# EAGLE design OP_Current_Fun-V0_1 (EAGLE 6.3)
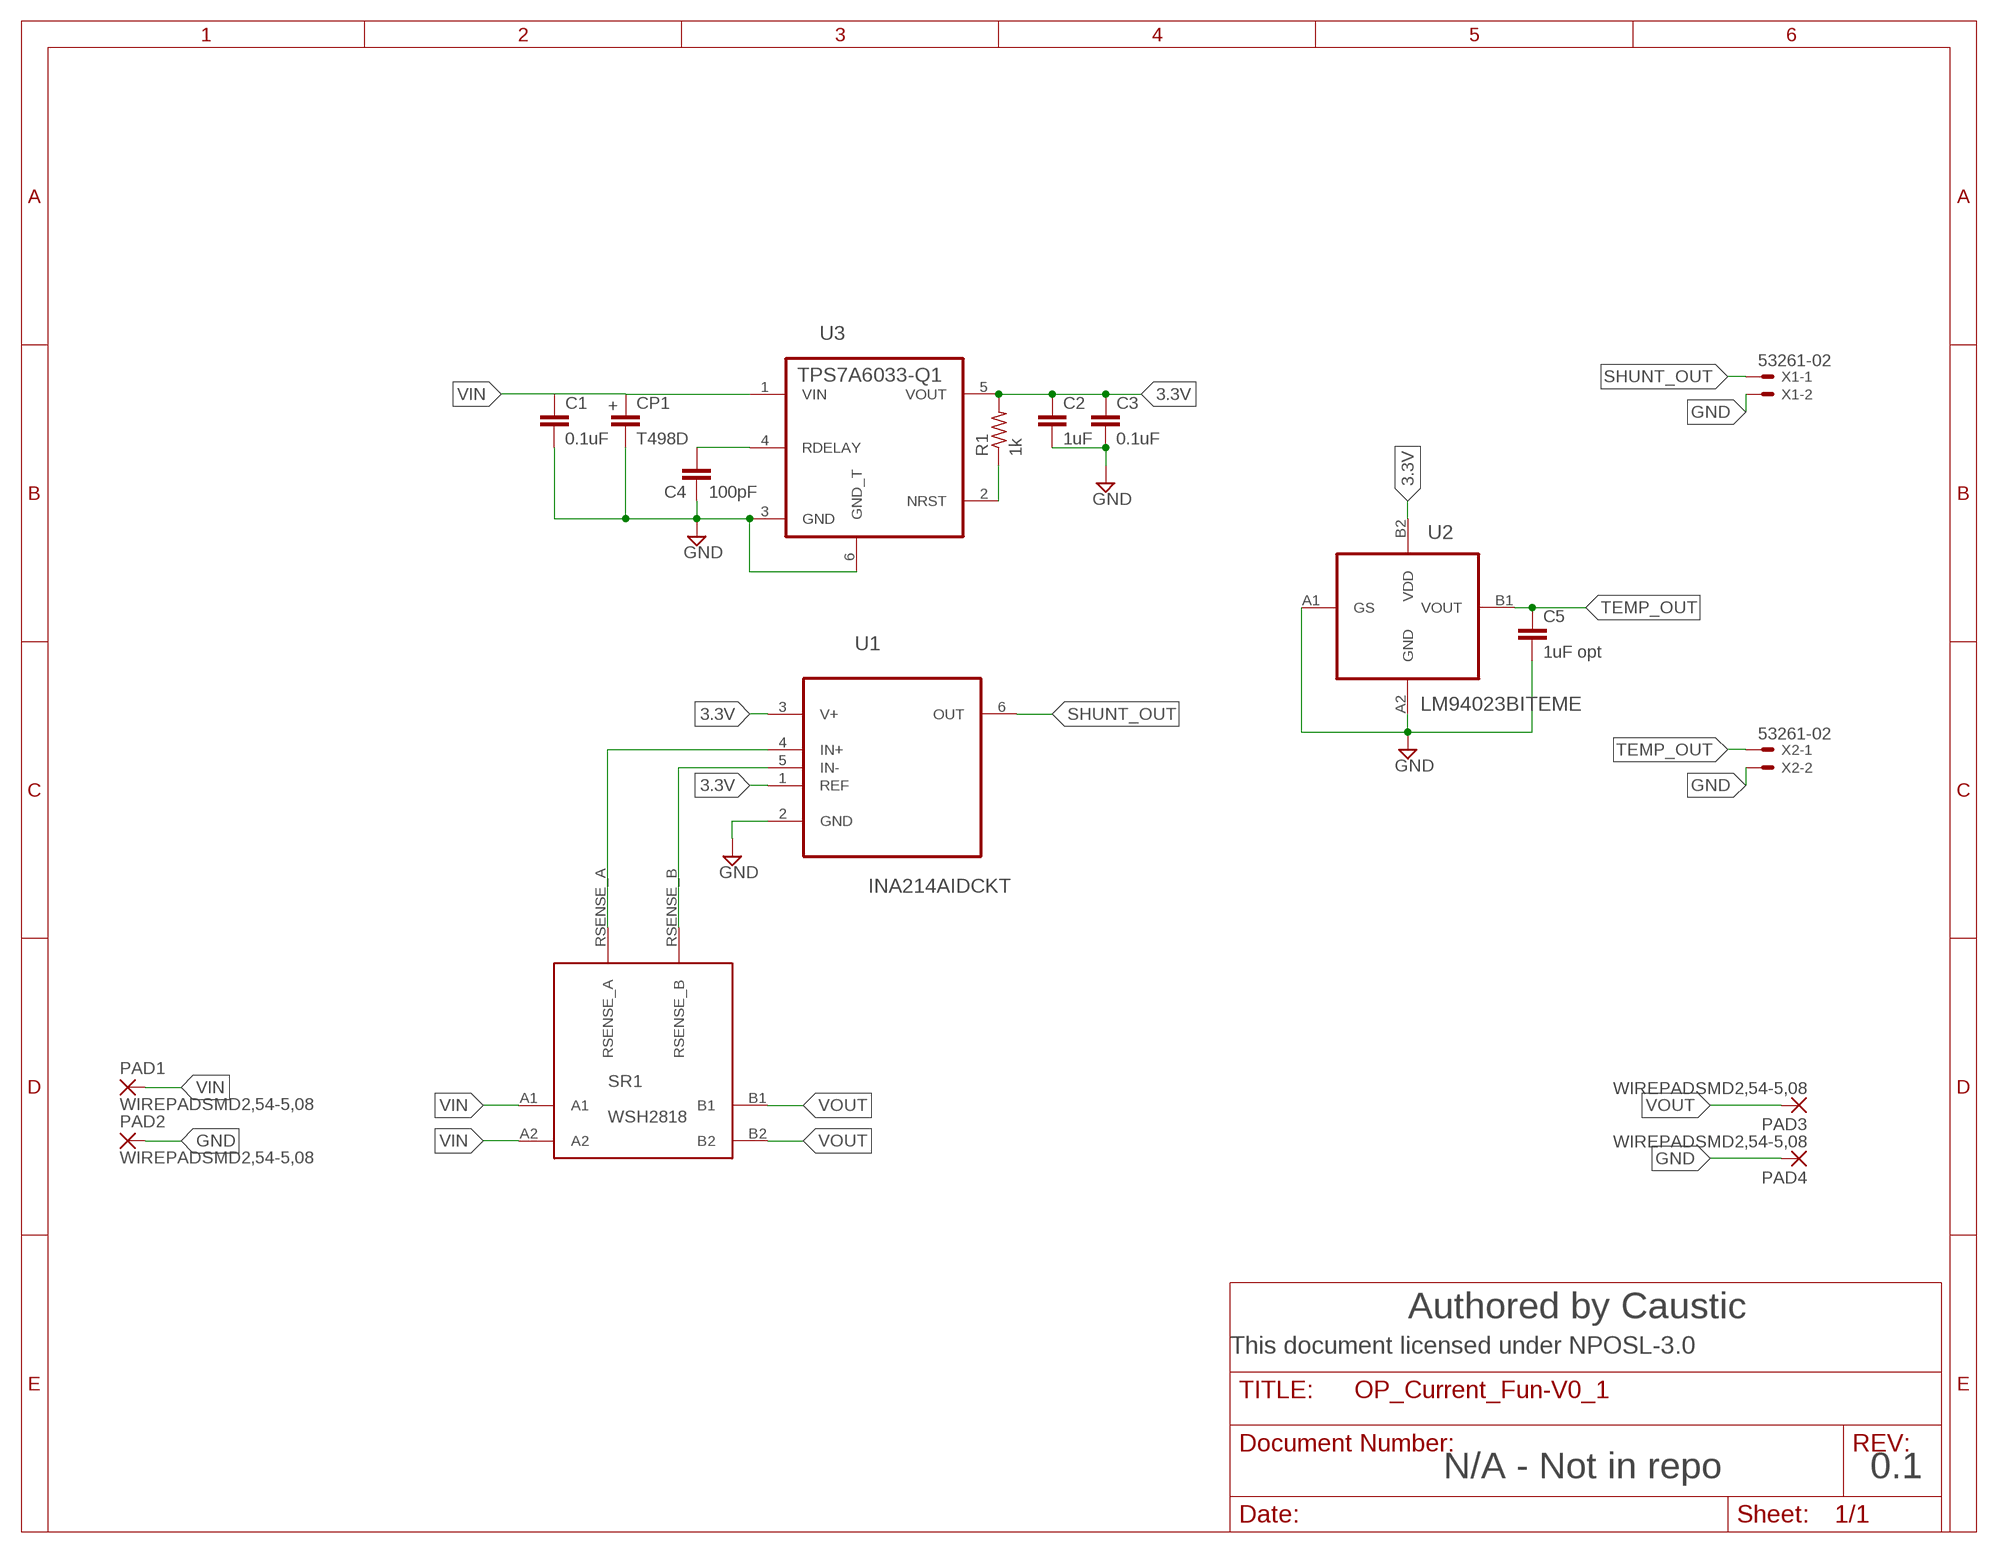
[diagram p0: schematic, sheet 1]

## Parts
C1  0.1uF  C-EUC0603K  [C0603K]
C2  1uF  C-EUC0603K  [C0603K]
C3  0.1uF  C-EUC0603K  [C0603K]
C4  100pF  C-EUC0805K  [C0805K]
C5  1uF opt  C-EUC0603K  [C0603K]
CP1  T498D  [CT7343]
PAD1  WIREPADSMD2,54-5,08  [SMD2,54-5,08]
PAD2  WIREPADSMD2,54-5,08  [SMD2,54-5,08]
PAD3  WIREPADSMD2,54-5,08  [SMD2,54-5,08]
PAD4  WIREPADSMD2,54-5,08  [SMD2,54-5,08]
R1  1k  R-US_R0402  [R0402]
SR1  WSH2818  [2818]
U1  INA214AIDCKT  [SOT65P210X110-6N]
U2  LM94023BITEME  [BGA4C40P2X2_76X76X63]
U3  TPS7A6033-Q1  [TO-263-5]
X1  53261-02  [53261-02]
X2  53261-02  [53261-02]

## Nets
3.3V: C2.1 C3.1 R1.2 U1.1(REF) U1.3(V+) U2.B2(VDD) U3.5(VOUT)
GND: C1.2 C2.2 C3.2 C4.1 C5.2 CP1.- PAD2.1(P) PAD4.1(P) U1.2(GND) U2.A1(GS) U2.A2(GND) U3.3(GND) U3.6(GND_T) X1.2 X2.2
N$1: SR1.RSENSE_A U1.4(IN+)
N$2: SR1.RSENSE_B U1.5(IN-)
N$4: C4.2 U3.4(RDELAY)
N$9: R1.1 U3.2(NRST)
SHUNT_OUT: U1.6(OUT) X1.1
TEMP_OUT: C5.1 U2.B1(VOUT) X2.1
VIN: C1.1 CP1.+ PAD1.1(P) SR1.A1 SR1.A2 U3.1(VIN)
VOUT: PAD3.1(P) SR1.B1 SR1.B2

## Notes on the sheet
- Authored by Caustic
- This document licensed under NPOSL-3.0
- N/A - Not in repo | 0.1

## Library data of the parts
C1-C5 = rcl:C-EU: CAPACITOR, European symbol
CP1 = Kemet:T498D: Kemet T498 D series Tantalum SMD Cap
PAD1-PAD4 = wirepad:WIREPAD: Wire PAD connect wire on PCB
R1 = rcl:R-US_: RESISTOR, American symbol
SR1 = VISHAY:WSH2818
U1 = TI:INA214AIDCKT: CURRENT SHUNT MONITOR; MPN: INA214AIDCKT; OC_FARNELL: 1754262; OC_NEWARK: 05N1041; PACKAGE: SC-70-6; SUPPLIER: Texas Instruments
U2 = TI:LM94023BITEME
U3 = TI_TPS:TPS7A6033-Q1: TPS7A6033-Q1
X1 X2 = con-molex:53?-02: CONNECTOR wire to board 1.25 mm (.049 inch) pitch header; OC_FARNELL: 1125373; OC_NEWARK: unknown

## Board
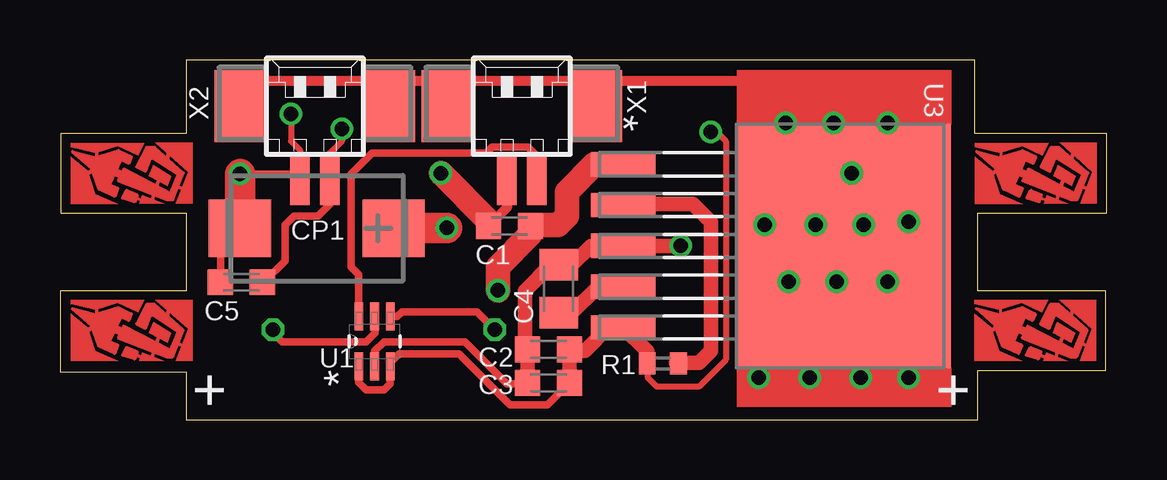
[diagram p1: board, top side]
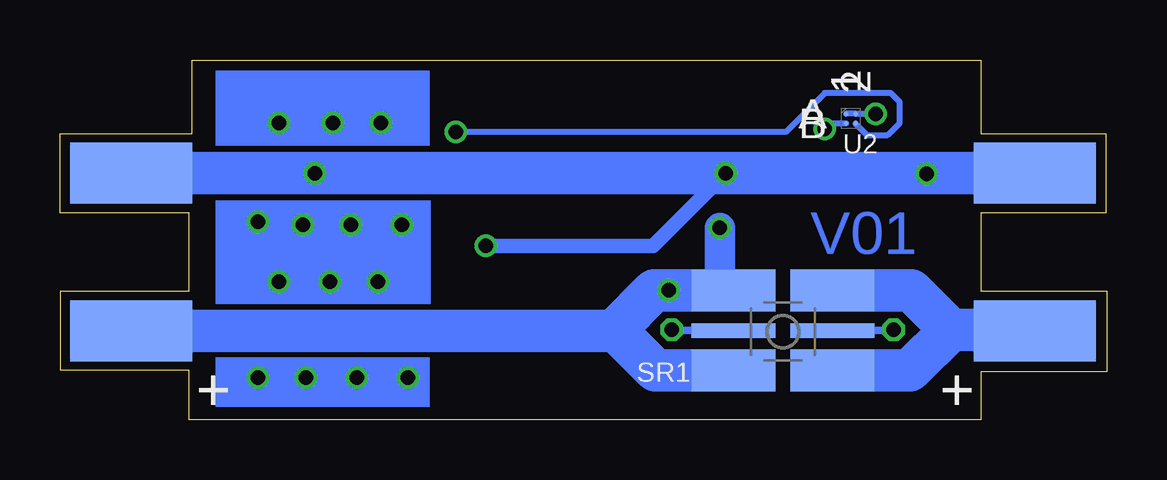
[diagram p2: board, bottom side, seen from below]

Size 43.62 x 15 mm. Coordinates in mm from the lower left corner, seen from the top.
Outline: 5.25,0 38.25,0 38.25,2.05 43.59,2.05 43.59,5.36 38.25,5.36 38.25,8.62 43.62,8.62 43.62,11.93 38.12,11.93 38.12,15 5.25,15 5.25,11.94 0.02,11.94 0.02,8.62 5.25,8.62 5.25,5.38 0,5.38 0,2 5.25,2 5.25,0
Copper layers (1*16): Top 0.0356mm / dielectric 1.5011mm / Bottom 0.0356mm
Design rules "LaenPCBOrder": minimum track width 6mil, minimum drill 13mil, track to track 6mil, track to pad 6mil, pad to pad 6mil, via to via 6mil, smd to smd 6mil, copper to edge 15mil, drill to drill 6mil, minimum pad ring 7mil, minimum via ring 7mil, stop-mask expansion 4mil, vias tented up to drill 0mil, thermal gap 10mil

### Footprints (pad centres in the part's own frame; a part is rotated, then mirrored left to right if it is on the bottom)
C0603K = smd 1.05 x 1.08: 1 -0.875,0; 2 0.875,0
C0805K = smd 1.3 x 1.6: 1 -1,0; 2 1,0
CT7343 = smd 2.6 x 2.4: + -3.2,0; - 3.2,0
SMD2,54-5,08 = smd 2.54 x 5.08: 1 0,0
R0402 = smd 0.7 x 0.9: 1 -0.65,0; 2 0.65,0
2818 = smd 3.5 x 1.75: A1 2.061,1.625; A2 2.061,-1.719; B1 -2.061,1.625; B2 -2.061,-1.719 | smd 3.5 x 0.6: RSENSE_A 2.061,-0.044; RSENSE_B -2.061,-0.044
SOT65P210X110-6N = smd 1.168 x 0.356: 1 -1.041,0.66; 2 -1.041,0; 3 -1.041,-0.66; 4 1.041,-0.66; 5 1.041,0; 6 1.041,0.66
BGA4C40P2X2_76X76X63 = smd 0.203 x 0.203: A1 -0.203,0.203; A2 0.203,0.203; B1 -0.203,-0.203; B2 0.203,-0.203
TO-263-5 = smd 1.016 x 2.692: 1 -3.404,-7.772; 2 -1.702,-7.772; 3 0,-7.772; 4 1.702,-7.772; 5 3.404,-7.772 | smd 10.16 x 8.941: 6 0,1.422
53261-02 = smd 0.8 x 2: 1 0.625,-2.5; 2 -0.625,-2.5 | smd 2.1 x 3: S1 3.125,0.625; S2 -3.125,0.625

### Placement (x,y rotation side)
C1  18.73,8.07 180 top
C2  20.36,2.92 180 top
C3  20.36,1.53 180 top
C4  20.79,5.46 270 top
C5  7.57,5.73 180 top
CP1  10.71,7.99 180 top
PAD1  40.66,3.71 90 bottom
PAD2  40.66,10.28 90 bottom
PAD3  2.99,3.71 90 bottom
PAD4  2.99,10.28 90 bottom
R1  25.13,2.34 180 top
SR1  13.49,3.67 180 bottom
U1  13.12,3.27 90 top
U2  10.66,12.55 0 bottom
U3  31.25,7.25 270 top
U$1  [LOGO2,54X5,08PAD]  40.67,10.28 0 top
U$2  [LOGO2,54X5,08PAD]  40.65,3.73 0 top
U$3  [LOGO2,54X5,08PAD]  2.98,10.28 0 top
U$4  [LOGO2,54X5,08PAD]  2.98,3.73 0 top
X1  19.25,12.44 0 top
X2  10.62,12.44 0 top

### Tracks (layer width: path | path; a pad name or v marks a point on that pad's centre or on a via)
3.3V  (via drill 0.6 pad 0.25)
  Top 0.254: v27.12,12 27.38,12 27.75,11.62 27.75,2.5 26.62,1.38 24.88,1.38 24.5,1.75 24.5,2.33 R1.2
  Top 0.305: U1.1 12.46,1.54 12.75,1.25 13.5,1.25 13.75,1.5 13.75,2.2 | 13.75,2.2 U1.3 | 13.75,2.2 13.75,2.38 14.12,2.75 16.62,2.75 18.75,0.62 20.33,0.62 C3.1
  Top 0.61: C3.1 C2.1 21.16,2.88 21.88,2.88 22.84,3.84 U3.5 24.48,2.84 R1.2
  Bottom 0.254: U2.B2 10.46,12.33 10,11.88 9.12,11.88 8.62,12.38 8.62,13.25 9,13.62 11.75,13.62 13.38,12 v27.12,12
GND  (via drill 0.6, 0.6 pad 0.25)
  Top 0.254: v9.62,12.75 9.62,11.62 10,11.25 X2.2
  Top 0.305: U1.2 13.12,2.87 13.5,3.25 16.88,3.25 18.62,1.5 19.45,1.5 C3.2 19.33,1.38 | v7.5,10.24 9.7,10.24 X2.2 | C5.2 6.69,7.17 CP1.-
  Top 0.406: X1.2 18.62,8.84 C1.2
  Top 0.61: C3.2 C2.2 19.38,2.94 19.38,5.38 20.46,6.46 C4.1 21.34,6.46 22.12,7.25 U3.3 | U3.3 | U3.3 v25.88,7.25
  Top 1.016: C1.2 17.86,8.29 v15.88,10.28 | U3.6 32.67,9.95 v33,10.28
  Top 1.27: CP1.- v7.5,10.24 v7.5,10.25
  Bottom 0.254: v9.62,12.75 v9.63,12.76 U2.A2 U2.A1
  Bottom 0.61: v25.88,7.25 18.9,7.25 v15.88,10.28
  Bottom 1.27: v7.5,10.25 3.46,10.25 PAD4.1
  Bottom 1.778: PAD2.1 v33,10.28 v15.88,10.28 PAD4.1
N$1  (via drill 0.6)
  Top 0.305: 13.75,4.28 U1.4 14.06,4.31 14.25,4.5 17.38,4.5 v18.12,3.75
  Bottom 0.305: SR1.RSENSE_A 17.96,3.71 v18.12,3.75
N$2  (via drill 0.6)
  Top 0.305: v8.88,3.75 8.88,3.62 9.25,3.25 12.75,3.25 13.12,3.62 13.12,4.3 U1.5
  Bottom 0.305: SR1.RSENSE_B 8.91,3.71 v8.88,3.75
N$3  (via drill 0.6 pad 0.25)
  other vias: 32.25,12.38
N$4
  Top 0.61: C4.2 21.34,4.46 22.38,5.5 23.43,5.5 U3.4
N$5  (via drill 0.6 pad 0.25)
  other vias: 34.5,12.38
N$6  (via drill 0.6 pad 0.25)
  other vias: 30.25,12.38
N$7  (via drill 0.6 pad 0.25)
  other vias: 29.38,8.12
N$8  (via drill 0.6 pad 0.25)
  other vias: 31.5,8.12
N$9
  Top 0.61: U3.2 23.53,9 26.38,9 27.12,8.25 27.12,2.88 26.62,2.38 25.81,2.38 R1.1 25.68,2.38
N$10  (via drill 0.6 pad 0.25)
  other vias: 33.5,8.12
N$11  (via drill 0.6 pad 0.25)
  other vias: 35.38,8.25
N$12  (via drill 0.6 pad 0.25)
  other vias: 34.5,5.75
N$13  (via drill 0.6 pad 0.25)
  other vias: 32.38,5.75
N$14  (via drill 0.6 pad 0.25)
  other vias: 30.38,5.75
N$15  (via drill 0.6 pad 0.25)
  other vias: 29.12,1.75
N$16  (via drill 0.6 pad 0.25)
  other vias: 31.25,1.75
N$17  (via drill 0.6 pad 0.25)
  other vias: 33.38,1.75
N$18  (via drill 0.6 pad 0.25)
  other vias: 35.38,1.75
N$19
  Top 0.406: 36.25,14.12 7,14.12
SHUNT_OUT
  Top 0.305: U1.6 12.46,6.04 12.12,6.38 12.12,10.25 13,11.12 17.75,11.12 18,11.38 19.5,11.38 19.88,11 X1.1
TEMP_OUT  (via drill 0.6 pad 0.25)
  Top 0.254: v11.75,12.12 11.75,11.62 11.25,11.12 X2.1
  Top 0.305: C5.1 8.48,5.73 9.38,6.62 9.38,8.12 9.75,8.5 10.75,8.5 11.25,9 X2.1
  Bottom 0.254: U2.B1 11.52,12.35 v11.75,12.12
VIN  (via drill 0.6)
  Top 1.016: U3.1 22.27,10.65 21.12,9.5 21.12,8.5 20.75,8.12 19.66,8.12 C1.1 19.61,7.74 18.25,6.38 v18.25,5.39
  Top 1.27: CP1.+ 16.11,7.99 v16.12,8
  Bottom 1.27: v16.12,8 16.12,5.76 16.5,5.39
  Bottom 1.778: SR1.A2 16.5,5.39 17.75,5.39 v18.25,5.39 18.86,5.39 20.5,3.75 | SR1.A1 18.8,2.04 20.5,3.75 | PAD1.1 20.55,3.71 20.5,3.75
VOUT
  Bottom 1.778: SR1.B2 8.14,5.39 6.5,3.75 | SR1.B1 8.21,2.04 6.5,3.75 | 6.5,3.75 3.04,3.75 PAD3.1
(copper drawn outside any net)
  shapes: Bottom area x3, Top area x2

### Text on the board
Bottom: V01
tNames: + | +
bNames: + | +